# Altium project Deathsound Amplifier.PrjPcb
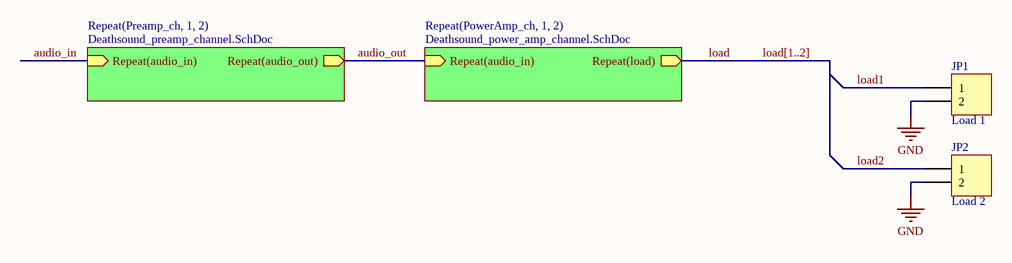
[diagram p0: Deathsound_preamp.SchDoc]
3 sheets, 116 parts. Net scope: hierarchical (ports join the sheet entries above them; power ports are global).
Sheets:
  Deathsound_preamp.SchDoc
    Preamp_ch1 = Deathsound_preamp_channel.SchDoc
    Preamp_ch2 = Deathsound_preamp_channel.SchDoc
    PowerAmp_ch1 = Deathsound_power_amp_channel.SchDoc
    PowerAmp_ch2 = Deathsound_power_amp_channel.SchDoc

## Sheet Deathsound_preamp.SchDoc
size A4

### Parts
JP1  Load 1  [HDR1X2]
JP2  Load 2  [HDR1X2]

### Sub-sheets
Repeat(PowerAmp_ch, 1, 2) = Deathsound_power_amp_channel.SchDoc: Repeat(load) (out), Repeat(audio_in) (in)
Repeat(Preamp_ch, 1, 2) = Deathsound_preamp_channel.SchDoc: Repeat(audio_in) (in), Repeat(audio_out) (out)

### Nets
GND: JP1.2 JP2.2
audio_in: sheet Repeat(Preamp_ch, 1, 2)/Repeat(audio_in)
audio_out: sheet Repeat(Preamp_ch, 1, 2)/Repeat(audio_out), sheet Repeat(PowerAmp_ch, 1, 2)/Repeat(audio_in)
load: sheet Repeat(PowerAmp_ch, 1, 2)/Repeat(load)
load1: JP1.1
load2: JP2.1

### Buses and harness runs
bus load[1..2]

### Library data of the parts
JP1 JP2 = Header 2: Header, 2-Pin

## Sheet Deathsound_preamp_channel.SchDoc
size A4
Used 2 times, as channels Preamp_ch1, Preamp_ch2. Parts and nets are listed once, with the designators drawn on the sheet.
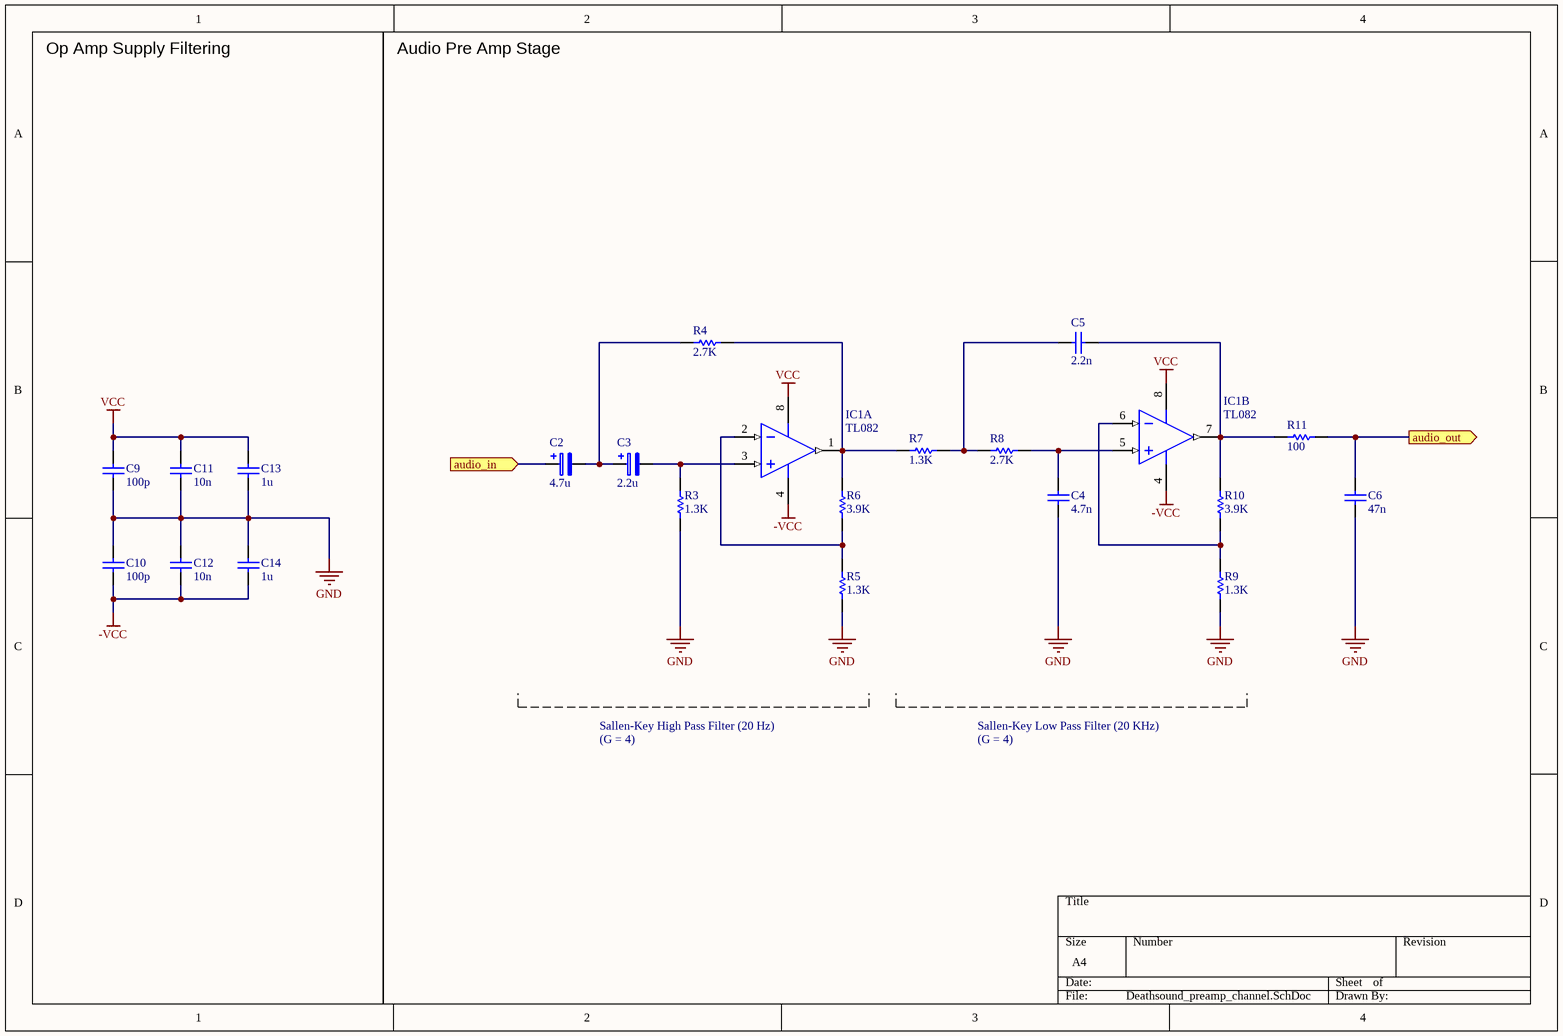
[diagram p1: Deathsound_preamp_channel.SchDoc]

### Parts
C2  4.7u  [CRADIAL-2mm]
C3  2.2u  [CRADIAL-2mm]
C4  4.7n  [C0805]
C5  2.2n  [C0805]
C6  47n  [C1206]
C9  100p  [C0805]
C10  100p  [C0805]
C11  10n  [C0805]
C12  10n  [C0805]
C13  1u  [C0805]
C14  1u  [C0805]
IC1  TL082  [SOIC127P600X175-8N]  (parts A,B of 2)
R3  1.3K  [R0805]
R4  2.7K  [R0805]
R5  1.3K  [R0805]
R6  3.9K  [R0805]
R7  1.3K  [R0805]
R8  2.7K  [R0805]
R9  1.3K  [R0805]
R10  3.9K  [R0805]
R11  100  [R0805]

### Ports
audio_in (in), audio_out (out)

### Nets
-VCC: C10.1 C12.1 C14.1 IC1.4(V-)
GND: C4.1 C6.1 C9.1 C10.2 C11.1 C12.2 C13.1 C14.2 R3.1 R5.2 R9.1
VCC: C9.2 C11.2 C13.2 IC1.8(V+)
audio_in: C2.1 ; port audio_in
audio_out: C6.2 R11.1 ; port audio_out
NetC2_2: C2.2 C3.1 R4.2
NetC3_2: C3.2 IC1.3(IN+1) R3.2
NetC4_2: C4.2 IC1.5(IN+2) R8.2
NetC5_1: C5.1 IC1.7(OUT2) R10.2 R11.2
NetC5_2: C5.2 R7.2 R8.1
NetIC1_1: IC1.1(OUT1) R4.1 R6.1 R7.1
NetIC1_2: IC1.2(IN-1) R5.1 R6.2
NetIC1_6: IC1.6(IN-2) R9.2 R10.1

### Channels
Preamp_ch1: designators end in _Preamp_ch1; ports audio_in=audio_in1 audio_out=audio_out1
Preamp_ch2: designators end in _Preamp_ch2; ports audio_in=audio_in2 audio_out=audio_out2

### Notes on the sheet
- Op Amp Supply Filtering
- Audio Pre Amp Stage
- Sallen-Key High Pass Filter (20 Hz)
- (G = 4)
- Sallen-Key Low Pass Filter (20 KHz)

### Library data of the parts
C2 C3 = Pol Capacitor: Polarized Capacitor
  C2: Value: 4.7u
  C3: Value: 2.2u
C4-C6 C9-C14 = Capacitor
  C4: Value: 4.7n
  C5: Value: 2.2n
  C6: Value: 47n
  C9 C10: Value: 100p
  C11 C12: Value: 10n
  C13 C14: Value: 1u
R3-R11 = Resistor
  R3 R5 R7 R9: Value: 1.3K
  R4 R8: Value: 2.7K
  R6 R10: Value: 3.9K
  R11: Value: 100

## Sheet Deathsound_power_amp_channel.SchDoc
size A4
Used 2 times, as channels PowerAmp_ch1, PowerAmp_ch2. Parts and nets are listed once, with the designators drawn on the sheet.
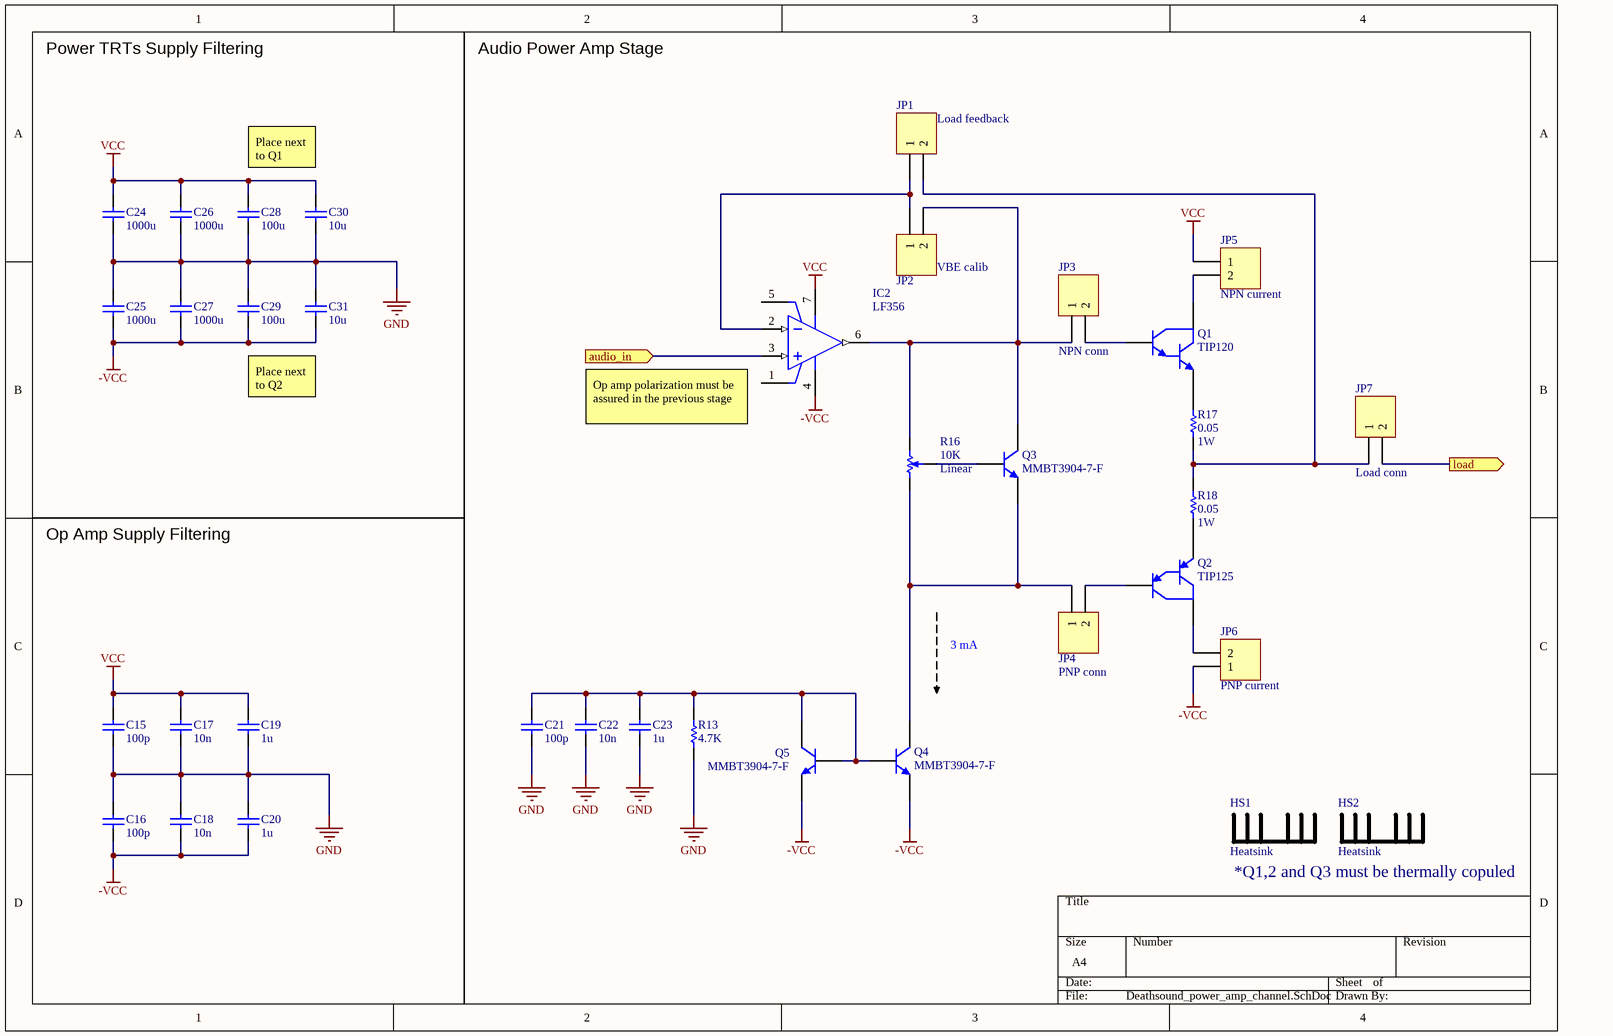
[diagram p2: Deathsound_power_amp_channel.SchDoc]

### Parts
C15  100p  [C0805]
C16  100p  [C0805]
C17  10n  [C0805]
C18  10n  [C0805]
C19  1u  [C0805]
C20  1u  [C0805]
C21  100p  [C0805]
C22  10n  [C0805]
C23  1u  [C0805]
C24  1000u  [C0805]
C25  1000u  [C0805]
C26  1000u  [C0805]
C27  1000u  [C0805]
C28  100u  [C0805]
C29  100u  [C0805]
C30  10u  [C0805]
C31  10u  [C0805]
HS1  Heatsink  [MC33289]
HS2  Heatsink  [MC33289]
IC2  LF356  [SOIC127P600X175-8N]
JP1  Load feedback  [HDR1X2]
JP2  VBE calib  [HDR1X2]
JP3  NPN conn  [HDR1X2]
JP4  PNP conn  [HDR1X2]
JP5  NPN current  [HDR1X2]
JP6  PNP current  [HDR1X2]
JP7  Load conn  [HDR1X2]
Q1  TIP120  [TO-220]
Q2  TIP125  [TO-220]
Q3  MMBT3904-7-F  [SOT95P240X110-3N]
Q4  MMBT3904-7-F  [SOT95P240X110-3N]
Q5  MMBT3904-7-F  [SOT95P240X110-3N]
R13  4.7K  [R0805]
R16  10K  Type: Linear  [Res Pot Square Trimm]
R17  0.05  Power: 1W  [R2512]
R18  0.05  Power: 1W  [R2512]

### Ports
audio_in (in), load (out)

### Nets
-VCC: C16.1 C18.1 C20.1 C25.1 C27.1 C29.1 C31.1 IC2.4(V-) JP6.1 Q4.2(E) Q5.2(E)
GND: C15.1 C16.2 C17.1 C18.2 C19.1 C20.2 C21.1 C22.1 C23.1 C24.1 C25.2 C26.1 C27.2 C28.1 C29.2 C30.1 C31.2 R13.2
VCC: C15.2 C17.2 C19.2 C24.2 C26.2 C28.2 C30.2 IC2.7(V+) JP5.1
audio_in: IC2.3(IN+) ; port audio_in
load: JP7.2 ; port load
NetC21_2: C21.2 C22.2 C23.2 Q4.1(B) Q5.1(B) Q5.3(C) R13.1
NetIC2_2: IC2.2(IN-) JP1.1 JP2.1
NetIC2_6: IC2.6(OUT) JP2.2 JP3.1 Q3.3(C) R16.1
NetJP1_2: JP1.2 JP7.1 R17.1 R18.2
NetJP3_2: JP3.2 Q1.1(B)
NetJP4_1: JP4.1 Q3.2(E) Q4.3(C) R16.3
NetJP4_2: JP4.2 Q2.1(B)
NetJP5_2: JP5.2 Q1.2(C)
NetJP6_2: JP6.2 Q2.2(C)
NetQ1_3: Q1.3(E) R17.2
NetQ2_3: Q2.3(E) R18.1
NetQ3_1: Q3.1(B) R16.2

Not connected (* = marked no-connect by the designer): IC2 1(BALANCE1) 5(BALANCE2)

### Channels
PowerAmp_ch1: designators end in _PowerAmp_ch1; ports audio_in=audio_out1 load=load1
PowerAmp_ch2: designators end in _PowerAmp_ch2; ports audio_in=audio_out2 load=load2

### Notes on the sheet
- Power TRTs Supply Filtering
- Audio Power Amp Stage
- Place next
  to Q1
- Place next
  to Q2
- (near IC2) Op amp polarization must be
  assured in the previous stage
- Op Amp Supply Filtering
- 3 mA
- *Q1,2 and Q3 must be thermally copuled

### Library data of the parts
C15-C31 = Capacitor
  C15 C16 C21: Value: 100p
  C17 C18 C22: Value: 10n
  C19 C20 C23: Value: 1u
  C24-C27: Value: 1000u
  C28 C29: Value: 100u
  C30 C31: Value: 10u
HS1 = Heatsink (MC33289): Q1 Heatsink
HS2 = Heatsink (MC33289): Q2 Heatsink
JP1-JP7 = Header 2: Header, 2-Pin
Q1 = TIP120/121/122: NPN Darlington Bipolar Transistor
Q2 = TIP125/126/127: PNP Darlington Bipolar Transistor
Q3-Q5 = MMBT3904-7-F: NPN General Purpose Amplifier SMD
R13 R17 R18 = Resistor
  R13: Value: 4.7K
  R17 R18: Value: 0.05
R16 = Res Pot: Square Trimming Potentiometer; Value: 10K

## Nets that join several sheets
-VCC: Preamp_ch1 (C10_Preamp_ch1.1 C12_Preamp_ch1.1 C14_Preamp_ch1.1 IC1_Preamp_ch1.4), Preamp_ch2 (C10_Preamp_ch2.1 C12_Preamp_ch2.1 C14_Preamp_ch2.1 IC1_Preamp_ch2.4), PowerAmp_ch1 (11 pins), PowerAmp_ch2 (11 pins)
GND: Deathsound_preamp (JP1.2 JP2.2), Preamp_ch1 (11 pins), Preamp_ch2 (11 pins), PowerAmp_ch1 (18 pins), PowerAmp_ch2 (18 pins)
VCC: Preamp_ch1 (C9_Preamp_ch1.2 C11_Preamp_ch1.2 C13_Preamp_ch1.2 IC1_Preamp_ch1.8), Preamp_ch2 (C9_Preamp_ch2.2 C11_Preamp_ch2.2 C13_Preamp_ch2.2 IC1_Preamp_ch2.8), PowerAmp_ch1 (9 pins), PowerAmp_ch2 (9 pins)
audio_out1: Preamp_ch1 (C6_Preamp_ch1.2 R11_Preamp_ch1.1), PowerAmp_ch1 (IC2_PowerAmp_ch1.3)
audio_out2: Preamp_ch2 (C6_Preamp_ch2.2 R11_Preamp_ch2.1), PowerAmp_ch2 (IC2_PowerAmp_ch2.3)
load1: Deathsound_preamp (JP1.1), PowerAmp_ch1 (JP7_PowerAmp_ch1.2)
load2: Deathsound_preamp (JP2.1), PowerAmp_ch2 (JP7_PowerAmp_ch2.2)